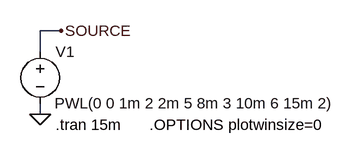
[diagram p0: schematic Fig_2-40_V-source-PWL.asc]
Fig_2-40_V-source-PWL.asc, the LTspice schematic file:
Version 4
SHEET 1 880 680
WIRE 144 80 112 80
WIRE 112 112 112 80
WIRE 112 208 112 192
FLAG 112 208 0
FLAG 144 80 SOURCE
SYMBOL voltage 112 96 R0
WINDOW 3 22 95 Left 2
WINDOW 123 0 0 Left 2
WINDOW 39 0 0 Left 2
SYMATTR Value PWL(0 0 1m 2 2m 5 8m 3 10m 6 15m 2)
SYMATTR InstName V1
TEXT 136 224 Left 2 !.tran 15m
TEXT 280 224 Left 2 !.OPTIONS plotwinsize=0

The netlist it stands for:
* Fig_2-40_V-source-PWL.asc
V1 SOURCE 0 PWL(0 0 1m 2 2m 5 8m 3 10m 6 15m 2)
.tran 15m
.OPTIONS plotwinsize=0
.backanno
.end